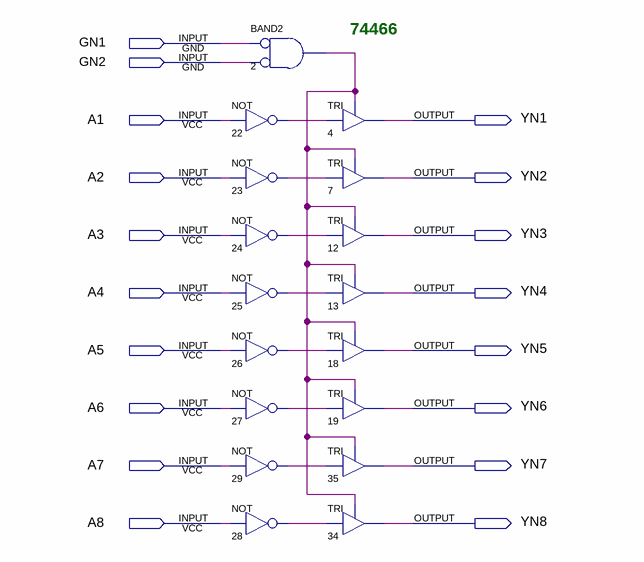
[diagram p0: schematic sheet]
// Quartus schematic 74466.bdf as structural Verilog: 17 symbols, 18 pins
module \74466  (
  input  GN1,
  input  GN2,
  input  A1,
  input  A2,
  input  A3,
  input  A4,
  input  A5,
  input  A6,
  input  A7,
  input  A8,
  output YN1,
  output YN2,
  output YN3,
  output YN4,
  output YN5,
  output YN6,
  output YN7,
  output YN8
);

  wire n2_out, n22_out, n23_out, n24_out, n25_out, n26_out, n27_out, n28_out, n29_out;

  not u_22 (n22_out, A1);
  not u_23 (n23_out, A2);
  not u_24 (n24_out, A3);
  not u_25 (n25_out, A4);
  not u_26 (n26_out, A5);
  not u_27 (n27_out, A6);
  not u_29 (n29_out, A7);
  not u_28 (n28_out, A8);
  and u_2 (n2_out, ~GN1, ~GN2);  // BAND2
  TRI u_4 (.IN(n22_out), .OE(n2_out), .OUT(YN1));
  TRI u_7 (.IN(n23_out), .OE(n2_out), .OUT(YN2));
  TRI u_12 (.IN(n24_out), .OE(n2_out), .OUT(YN3));
  TRI u_13 (.IN(n25_out), .OE(n2_out), .OUT(YN4));
  TRI u_18 (.IN(n26_out), .OE(n2_out), .OUT(YN5));
  TRI u_19 (.IN(n27_out), .OE(n2_out), .OUT(YN6));
  TRI u_35 (.IN(n29_out), .OE(n2_out), .OUT(YN7));
  TRI u_34 (.IN(n28_out), .OE(n2_out), .OUT(YN8));

  // Notes on the sheet:
  //   74466
endmodule
